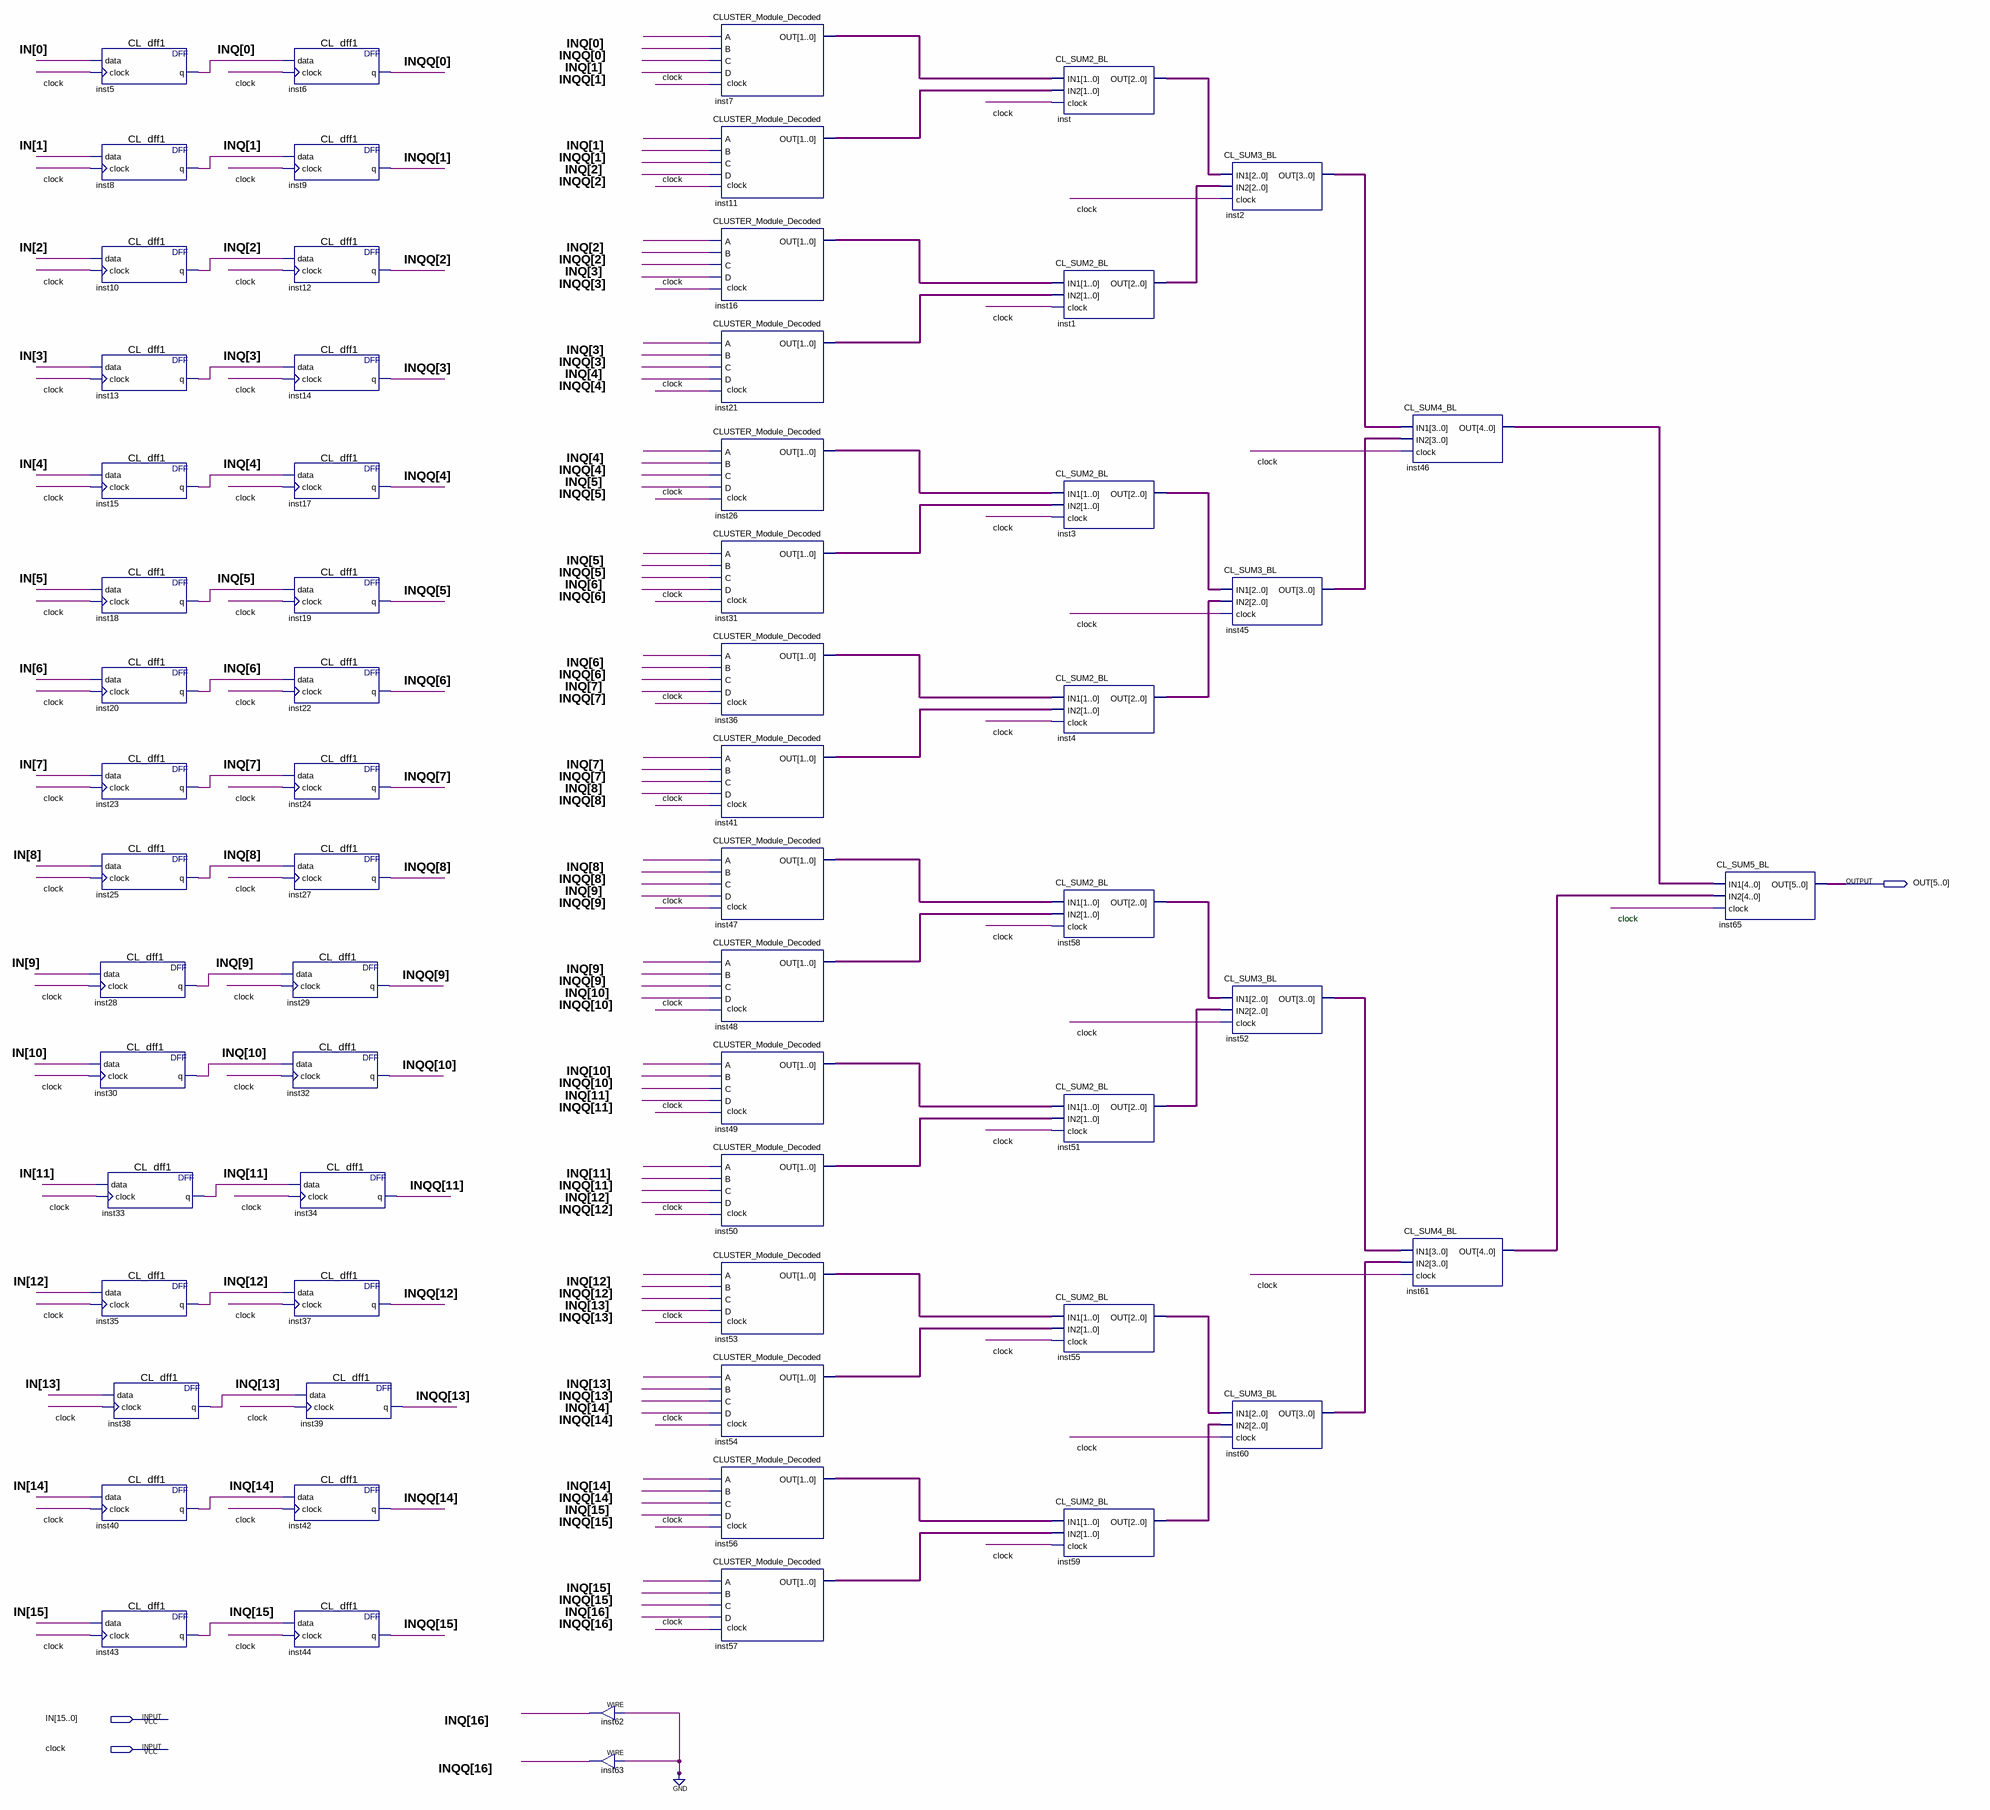
[diagram p0: schematic sheet]
// Quartus schematic CL_ClusterCounter_128.bdf as structural Verilog: 65 symbols, 3 pins
module CL_ClusterCounter_128 (
  input  [15:0] IN,
  input  clock,
  output [5:0] OUT
);

  wire [1:0] inst7_out, inst11_out, inst16_out, inst21_out, inst26_out, inst31_out, inst36_out, inst41_out,
       inst47_out, inst48_out, inst49_out, inst50_out, inst53_out, inst54_out, inst56_out, inst57_out;
  wire [2:0] inst1_out, inst3_out, inst4_out, inst51_out, inst55_out, inst58_out, inst59_out, inst_out;
  wire [3:0] inst2_out, inst45_out, inst52_out, inst60_out;
  wire [4:0] inst46_out, inst61_out;
  wire [16:0] INQ, INQQ;

  CL_dff1 inst28 (.data(IN[9]), .clock(clock), .q(INQ[9]));
  CL_dff1 inst30 (.data(IN[10]), .clock(clock), .q(INQ[10]));
  CL_dff1 inst5 (.data(IN[0]), .clock(clock), .q(INQ[0]));
  CL_dff1 inst8 (.data(IN[1]), .clock(clock), .q(INQ[1]));
  CL_dff1 inst10 (.data(IN[2]), .clock(clock), .q(INQ[2]));
  CL_dff1 inst13 (.data(IN[3]), .clock(clock), .q(INQ[3]));
  CL_dff1 inst15 (.data(IN[4]), .clock(clock), .q(INQ[4]));
  CL_dff1 inst18 (.data(IN[5]), .clock(clock), .q(INQ[5]));
  CL_dff1 inst20 (.data(IN[6]), .clock(clock), .q(INQ[6]));
  CL_dff1 inst23 (.data(IN[7]), .clock(clock), .q(INQ[7]));
  CL_dff1 inst25 (.data(IN[8]), .clock(clock), .q(INQ[8]));
  CL_dff1 inst33 (.data(IN[11]), .clock(clock), .q(INQ[11]));
  CL_dff1 inst35 (.data(IN[12]), .clock(clock), .q(INQ[12]));
  CL_dff1 inst38 (.data(IN[13]), .clock(clock), .q(INQ[13]));
  CL_dff1 inst40 (.data(IN[14]), .clock(clock), .q(INQ[14]));
  CL_dff1 inst43 (.data(IN[15]), .clock(clock), .q(INQ[15]));
  CL_dff1 inst29 (.data(INQ[9]), .clock(clock), .q(INQQ[9]));
  CL_dff1 inst32 (.data(INQ[10]), .clock(clock), .q(INQQ[10]));
  CL_dff1 inst6 (.data(INQ[0]), .clock(clock), .q(INQQ[0]));
  CL_dff1 inst9 (.data(INQ[1]), .clock(clock), .q(INQQ[1]));
  CL_dff1 inst12 (.data(INQ[2]), .clock(clock), .q(INQQ[2]));
  CL_dff1 inst14 (.data(INQ[3]), .clock(clock), .q(INQQ[3]));
  CL_dff1 inst17 (.data(INQ[4]), .clock(clock), .q(INQQ[4]));
  CL_dff1 inst19 (.data(INQ[5]), .clock(clock), .q(INQQ[5]));
  CL_dff1 inst22 (.data(INQ[6]), .clock(clock), .q(INQQ[6]));
  CL_dff1 inst24 (.data(INQ[7]), .clock(clock), .q(INQQ[7]));
  CL_dff1 inst27 (.data(INQ[8]), .clock(clock), .q(INQQ[8]));
  CL_dff1 inst34 (.data(INQ[11]), .clock(clock), .q(INQQ[11]));
  CL_dff1 inst37 (.data(INQ[12]), .clock(clock), .q(INQQ[12]));
  CL_dff1 inst39 (.data(INQ[13]), .clock(clock), .q(INQQ[13]));
  CL_dff1 inst42 (.data(INQ[14]), .clock(clock), .q(INQQ[14]));
  CL_dff1 inst44 (.data(INQ[15]), .clock(clock), .q(INQQ[15]));
  assign INQ[16] = 1'b0;  // WIRE inst62
  assign INQQ[16] = 1'b0;  // WIRE inst63
  CLUSTER_Module_Decoded inst7 (.A(INQ[0]), .B(INQQ[0]), .C(INQ[1]), .D(INQQ[1]), .clock(clock), .OUT(inst7_out));
  CLUSTER_Module_Decoded inst11 (.A(INQ[1]), .B(INQQ[1]), .C(INQ[2]), .D(INQQ[2]), .clock(clock), .OUT(inst11_out));
  CLUSTER_Module_Decoded inst16 (.A(INQ[2]), .B(INQQ[2]), .C(INQ[3]), .D(INQQ[3]), .clock(clock), .OUT(inst16_out));
  CLUSTER_Module_Decoded inst21 (.A(INQ[3]), .B(INQQ[3]), .C(INQ[4]), .D(INQQ[4]), .clock(clock), .OUT(inst21_out));
  CLUSTER_Module_Decoded inst26 (.A(INQ[4]), .B(INQQ[4]), .C(INQ[5]), .D(INQQ[5]), .clock(clock), .OUT(inst26_out));
  CLUSTER_Module_Decoded inst31 (.A(INQ[5]), .B(INQQ[5]), .C(INQ[6]), .D(INQQ[6]), .clock(clock), .OUT(inst31_out));
  CLUSTER_Module_Decoded inst36 (.A(INQ[6]), .B(INQQ[6]), .C(INQ[7]), .D(INQQ[7]), .clock(clock), .OUT(inst36_out));
  CLUSTER_Module_Decoded inst41 (.A(INQ[7]), .B(INQQ[7]), .C(INQ[8]), .D(INQQ[8]), .clock(clock), .OUT(inst41_out));
  CLUSTER_Module_Decoded inst47 (.A(INQ[8]), .B(INQQ[8]), .C(INQ[9]), .D(INQQ[9]), .clock(clock), .OUT(inst47_out));
  CLUSTER_Module_Decoded inst48 (.A(INQ[9]), .B(INQQ[9]), .C(INQ[10]), .D(INQQ[10]), .clock(clock), .OUT(inst48_out));
  CLUSTER_Module_Decoded inst49 (.A(INQ[10]), .B(INQQ[10]), .C(INQ[11]), .D(INQQ[11]), .clock(clock), .OUT(inst49_out));
  CLUSTER_Module_Decoded inst50 (.A(INQ[11]), .B(INQQ[11]), .C(INQ[12]), .D(INQQ[12]), .clock(clock), .OUT(inst50_out));
  CLUSTER_Module_Decoded inst53 (.A(INQ[12]), .B(INQQ[12]), .C(INQ[13]), .D(INQQ[13]), .clock(clock), .OUT(inst53_out));
  CLUSTER_Module_Decoded inst54 (.A(INQ[13]), .B(INQQ[13]), .C(INQ[14]), .D(INQQ[14]), .clock(clock), .OUT(inst54_out));
  CLUSTER_Module_Decoded inst56 (.A(INQ[14]), .B(INQQ[14]), .C(INQ[15]), .D(INQQ[15]), .clock(clock), .OUT(inst56_out));
  CLUSTER_Module_Decoded inst57 (.A(INQ[15]), .B(INQQ[15]), .C(INQ[16]), .D(INQQ[16]), .clock(clock), .OUT(inst57_out));
  CL_SUM2_BL inst (.IN1(inst7_out), .IN2(inst11_out), .clock(clock), .OUT(inst_out));
  CL_SUM2_BL inst1 (.IN1(inst16_out), .IN2(inst21_out), .clock(clock), .OUT(inst1_out));
  CL_SUM2_BL inst3 (.IN1(inst26_out), .IN2(inst31_out), .clock(clock), .OUT(inst3_out));
  CL_SUM2_BL inst4 (.IN1(inst36_out), .IN2(inst41_out), .clock(clock), .OUT(inst4_out));
  CL_SUM2_BL inst58 (.IN1(inst47_out), .IN2(inst48_out), .clock(clock), .OUT(inst58_out));
  CL_SUM2_BL inst51 (.IN1(inst49_out), .IN2(inst50_out), .clock(clock), .OUT(inst51_out));
  CL_SUM2_BL inst55 (.IN1(inst53_out), .IN2(inst54_out), .clock(clock), .OUT(inst55_out));
  CL_SUM2_BL inst59 (.IN1(inst56_out), .IN2(inst57_out), .clock(clock), .OUT(inst59_out));
  CL_SUM3_BL inst2 (.IN1(inst_out), .IN2(inst1_out), .clock(clock), .OUT(inst2_out));
  CL_SUM3_BL inst45 (.IN1(inst3_out), .IN2(inst4_out), .clock(clock), .OUT(inst45_out));
  CL_SUM3_BL inst52 (.IN1(inst58_out), .IN2(inst51_out), .clock(clock), .OUT(inst52_out));
  CL_SUM3_BL inst60 (.IN1(inst55_out), .IN2(inst59_out), .clock(clock), .OUT(inst60_out));
  CL_SUM4_BL inst46 (.IN1(inst2_out), .IN2(inst45_out), .clock(clock), .OUT(inst46_out));
  CL_SUM4_BL inst61 (.IN1(inst52_out), .IN2(inst60_out), .clock(clock), .OUT(inst61_out));
  CL_SUM5_BL inst65 (.IN1(inst46_out), .IN2(inst61_out), .clock(clock), .OUT(OUT));

  // Notes on the sheet:
  //   clock
endmodule
